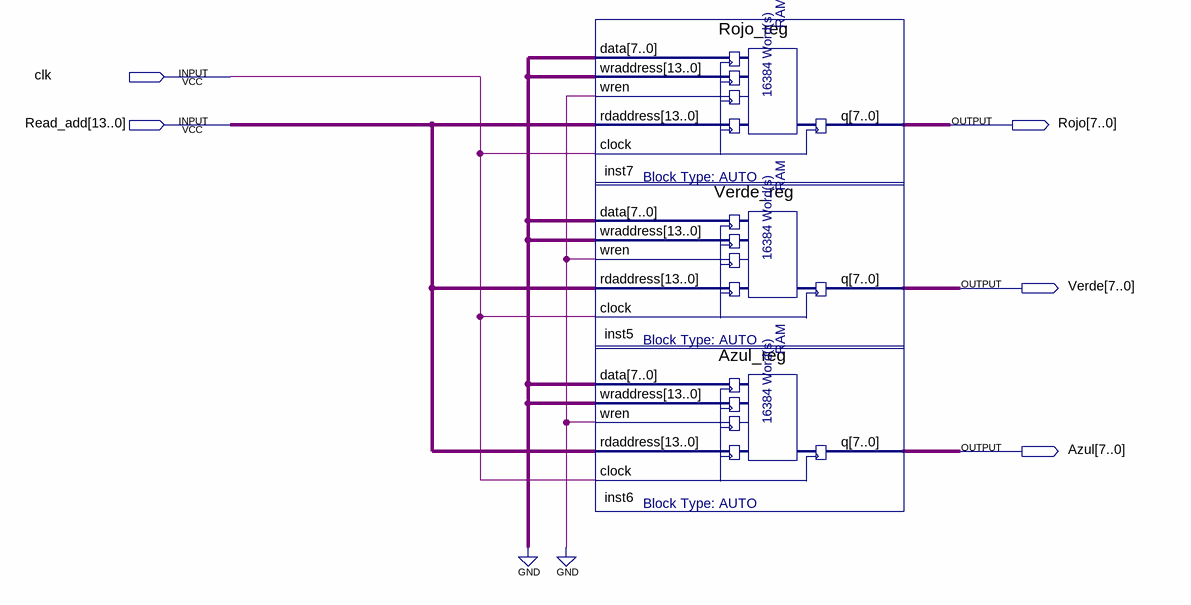
[diagram p0: schematic sheet]
// Quartus schematic Block1.bdf as structural Verilog: 3 symbols, 5 pins
module Block1 (
  input  clk,
  input  [13:0] Read_add,
  output [7:0] Rojo,
  output [7:0] Verde,
  output [7:0] Azul
);

  Rojo_reg inst7 (.data({14{1'b0}}), .wraddress({14{1'b0}}), .wren(1'b0), .rdaddress(Read_add), .clock(clk), .q(Rojo));
  Verde_reg inst5 (
    .data({14{1'b0}}), .wraddress({14{1'b0}}), .wren(1'b0), .rdaddress(Read_add), .clock(clk), .q(Verde));
  Azul_reg inst6 (.data({14{1'b0}}), .wraddress({14{1'b0}}), .wren(1'b0), .rdaddress(Read_add), .clock(clk), .q(Azul));
endmodule
